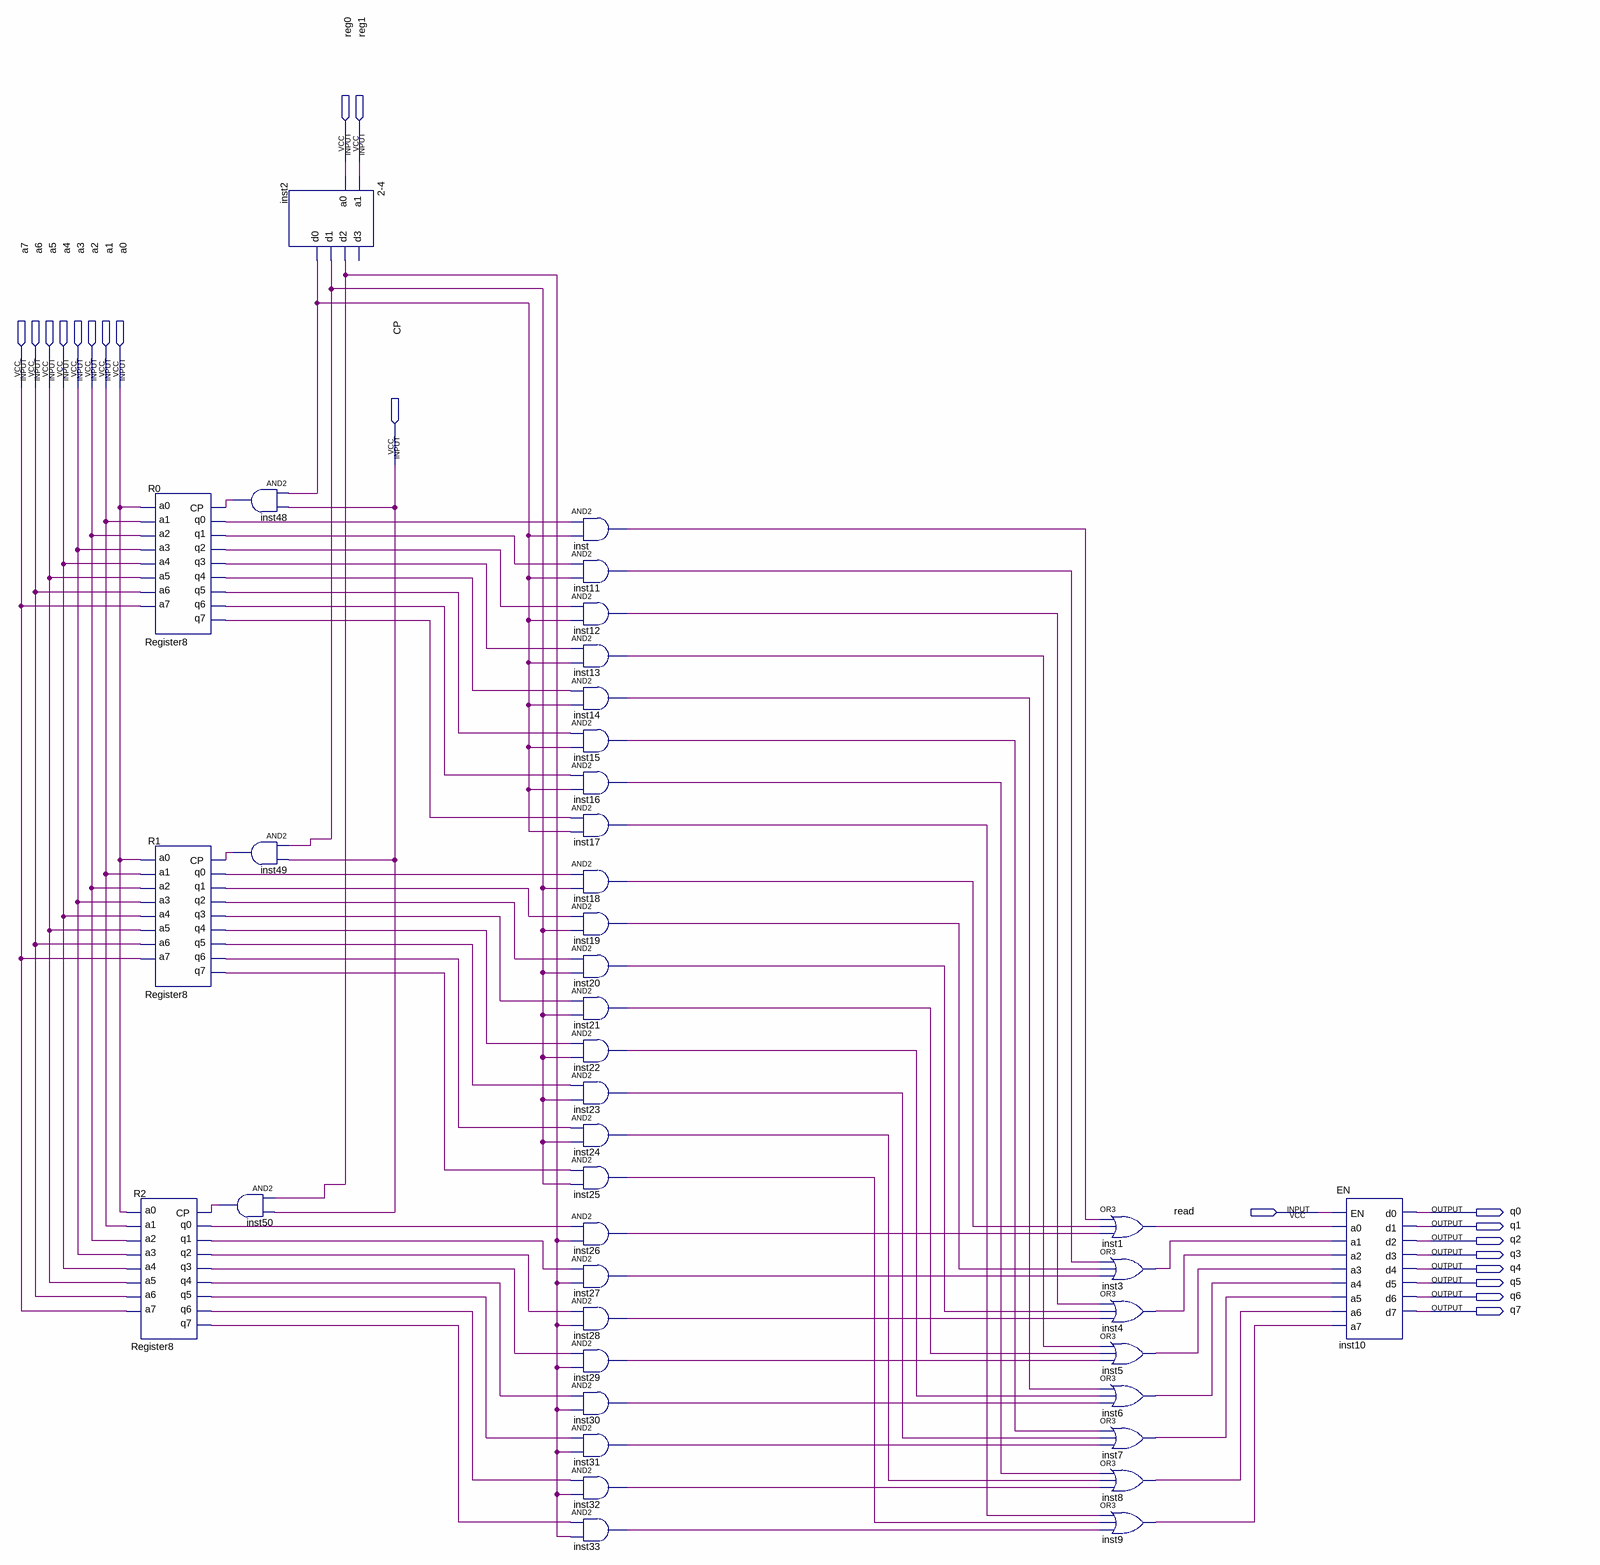
[diagram p0: schematic sheet]
// Quartus schematic Registers.bdf as structural Verilog: 40 symbols, 20 pins
module Registers (
  input  reg0,
  input  reg1,
  input  a7,
  input  a6,
  input  a5,
  input  a4,
  input  a3,
  input  a2,
  input  a1,
  input  a0,
  input  CP,
  input  read,
  output q0,
  output q1,
  output q2,
  output q3,
  output q4,
  output q5,
  output q6,
  output q7
);

  wire inst1_out, inst2_d0, inst2_d1, inst2_d2, inst3_out, inst4_out, inst5_out, inst6_out, inst7_out,
       inst8_out, inst9_out, inst11_out, inst12_out, inst13_out, inst14_out, inst15_out, inst16_out,
       inst17_out, inst18_out, inst19_out, inst20_out, inst21_out, inst22_out, inst23_out, inst24_out,
       inst25_out, inst26_out, inst27_out, inst28_out, inst29_out, inst30_out, inst31_out, inst32_out,
       inst33_out, inst48_out, inst49_out, inst50_out, inst_out, R0_q0, R0_q1, R0_q2, R0_q3, R0_q4, R0_q5,
       R0_q6, R0_q7, R1_q0, R1_q1, R1_q2, R1_q3, R1_q4, R1_q5, R1_q6, R1_q7, R2_q0, R2_q1, R2_q2, R2_q3,
       R2_q4, R2_q5, R2_q6, R2_q7;

  Register8 R0 (
    .CP(inst48_out), .a7(a7), .a6(a6), .a5(a5), .a4(a4), .a3(a3), .a2(a2), .a1(a1), .a0(a0), .q7(R0_q7),
    .q6(R0_q6), .q5(R0_q5), .q4(R0_q4), .q3(R0_q3), .q2(R0_q2), .q1(R0_q1), .q0(R0_q0));
  Register8 R1 (
    .CP(inst49_out), .a7(a7), .a6(a6), .a5(a5), .a4(a4), .a3(a3), .a2(a2), .a1(a1), .a0(a0), .q7(R1_q7),
    .q6(R1_q6), .q5(R1_q5), .q4(R1_q4), .q3(R1_q3), .q2(R1_q2), .q1(R1_q1), .q0(R1_q0));
  Register8 R2 (
    .CP(inst50_out), .a7(a7), .a6(a6), .a5(a5), .a4(a4), .a3(a3), .a2(a2), .a1(a1), .a0(a0), .q7(R2_q7),
    .q6(R2_q6), .q5(R2_q5), .q4(R2_q4), .q3(R2_q3), .q2(R2_q2), .q1(R2_q1), .q0(R2_q0));
  and inst50 (inst50_out, inst2_d2, CP);
  \2-4  inst2 (.a1(reg1), .a0(reg0), .d2(inst2_d2), .d1(inst2_d1), .d0(inst2_d0));  // open: d3
  and inst48 (inst48_out, inst2_d0, CP);
  and inst49 (inst49_out, inst2_d1, CP);
  and inst (inst_out, R0_q0, inst2_d0);
  and inst11 (inst11_out, R0_q1, inst2_d0);
  and inst12 (inst12_out, R0_q2, inst2_d0);
  and inst13 (inst13_out, R0_q3, inst2_d0);
  and inst14 (inst14_out, R0_q4, inst2_d0);
  and inst15 (inst15_out, R0_q5, inst2_d0);
  and inst16 (inst16_out, R0_q6, inst2_d0);
  and inst17 (inst17_out, R0_q7, inst2_d0);
  and inst18 (inst18_out, R1_q0, inst2_d1);
  and inst19 (inst19_out, R1_q1, inst2_d1);
  and inst20 (inst20_out, R1_q2, inst2_d1);
  and inst21 (inst21_out, R1_q3, inst2_d1);
  and inst22 (inst22_out, R1_q4, inst2_d1);
  and inst23 (inst23_out, R1_q5, inst2_d1);
  and inst24 (inst24_out, R1_q6, inst2_d1);
  and inst25 (inst25_out, R1_q7, inst2_d1);
  and inst26 (inst26_out, R2_q0, inst2_d2);
  and inst27 (inst27_out, R2_q1, inst2_d2);
  and inst28 (inst28_out, R2_q2, inst2_d2);
  and inst29 (inst29_out, R2_q3, inst2_d2);
  and inst30 (inst30_out, R2_q4, inst2_d2);
  and inst31 (inst31_out, R2_q5, inst2_d2);
  and inst32 (inst32_out, R2_q6, inst2_d2);
  and inst33 (inst33_out, R2_q7, inst2_d2);
  or inst1 (inst1_out, inst_out, inst18_out, inst26_out);
  or inst3 (inst3_out, inst11_out, inst19_out, inst27_out);
  or inst4 (inst4_out, inst12_out, inst20_out, inst28_out);
  or inst5 (inst5_out, inst13_out, inst21_out, inst29_out);
  or inst6 (inst6_out, inst14_out, inst22_out, inst30_out);
  or inst7 (inst7_out, inst15_out, inst23_out, inst31_out);
  or inst8 (inst8_out, inst16_out, inst24_out, inst32_out);
  or inst9 (inst9_out, inst17_out, inst25_out, inst33_out);
  EN inst10 (
    .EN(read), .a0(inst1_out), .a1(inst3_out), .a2(inst4_out), .a3(inst5_out), .a4(inst6_out),
    .a5(inst7_out), .a6(inst8_out), .a7(inst9_out), .d0(q0), .d1(q1), .d2(q2), .d3(q3), .d4(q4), .d5(q5),
    .d6(q6), .d7(q7));
endmodule
